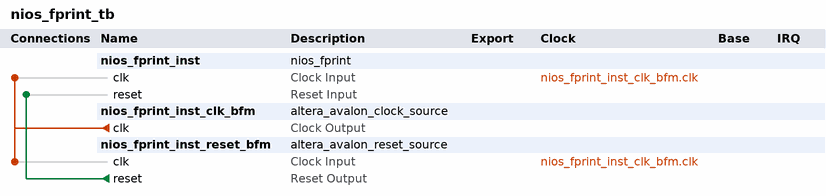
[diagram p0: system contents]
# Platform Designer (Qsys) system nios_fprint_tb, Arria V 5AGXFB3H4F35C5
# Parameters at their usual value, and those the tool derives, are not listed.
package require -exact qsys 13.1
create_system nios_fprint_tb
set_project_property DEVICE_FAMILY {Arria V}
set_project_property DEVICE 5AGXFB3H4F35C5

add_instance nios_fprint_inst nios_fprint 1.0

add_instance nios_fprint_inst_clk_bfm altera_avalon_clock_source 13.1

add_instance nios_fprint_inst_reset_bfm altera_avalon_reset_source 13.1
set_instance_parameter_value nios_fprint_inst_reset_bfm ASSERT_HIGH_RESET 0
set_instance_parameter_value nios_fprint_inst_reset_bfm INITIAL_RESET_CYCLES 50

# connections
add_connection nios_fprint_inst_clk_bfm.clk nios_fprint_inst.clk clock
add_connection nios_fprint_inst_clk_bfm.clk nios_fprint_inst_reset_bfm.clk clock
add_connection nios_fprint_inst_reset_bfm.reset nios_fprint_inst.reset reset

set_interconnect_requirement {$system} qsys_mm.clockCrossingAdapter HANDSHAKE
set_interconnect_requirement {$system} qsys_mm.maxAdditionalLatency 1
set_interconnect_requirement {$system} qsys_mm.insertDefaultSlave false

save_system nios_fprint_tb.qsys
